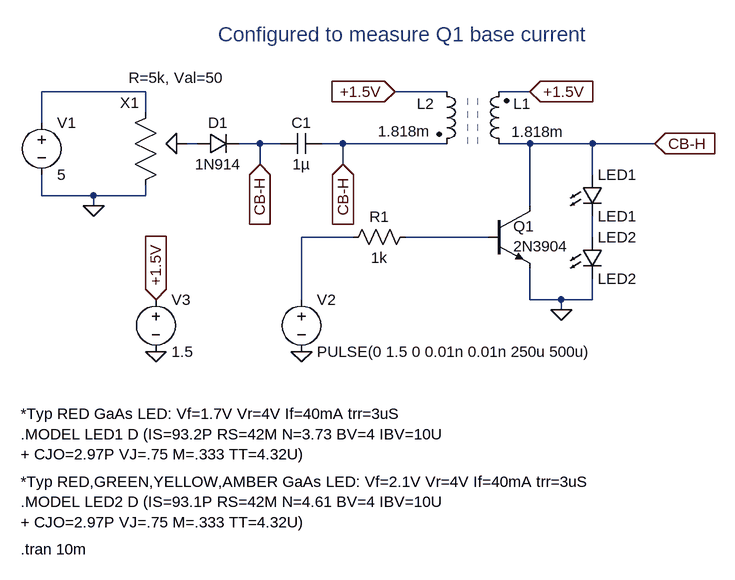
[diagram p0: schematic configured_to_measure_Q1_base_current_ltspice.asc]
configured_to_measure_Q1_base_current_ltspice.asc, the LTspice schematic file:
Version 4
SHEET 1 880 880
WIRE -320 160 -480 160
WIRE 144 160 64 160
WIRE 272 160 224 160
WIRE -320 192 -320 160
WIRE -480 208 -480 160
WIRE -240 240 -256 240
WIRE -144 240 -176 240
WIRE -112 240 -144 240
WIRE -16 240 -48 240
WIRE 144 240 -16 240
WIRE 272 240 224 240
WIRE 368 240 272 240
WIRE 464 240 368 240
WIRE -144 272 -144 240
WIRE -16 272 -16 240
WIRE 368 288 368 240
WIRE -480 320 -480 288
WIRE -400 320 -480 320
WIRE -320 320 -320 304
WIRE -320 320 -400 320
WIRE -400 336 -400 320
WIRE 272 336 272 240
WIRE 0 384 -80 384
WIRE 208 384 80 384
WIRE 368 384 368 352
WIRE -80 480 -80 384
WIRE 272 480 272 432
WIRE 320 480 272 480
WIRE 368 480 368 448
WIRE 368 480 320 480
WIRE 320 496 320 480
FLAG -400 336 0
FLAG 64 160 +1.5V
IOPIN 64 160 In
FLAG 272 160 +1.5V
IOPIN 272 160 In
FLAG -144 272 CB-H
IOPIN -144 272 In
FLAG -16 272 CB-H
IOPIN -16 272 In
FLAG 320 496 0
FLAG 464 240 CB-H
IOPIN 464 240 In
FLAG -80 560 0
FLAG -304 560 0
FLAG -304 480 +1.5V
IOPIN -304 480 In
SYMBOL ind2 240 256 R180
WINDOW 0 -33 77 Left 2
WINDOW 3 -3 34 Right 2
SYMATTR InstName L1
SYMATTR Value 1.818m
SYMATTR Type ind
SYMBOL ind2 128 144 R0
WINDOW 0 -30 35 Left 2
WINDOW 3 -90 77 Left 2
SYMATTR InstName L2
SYMATTR Value 1.818m
SYMATTR Type ind
SYMBOL cap -48 224 R90
WINDOW 0 0 32 VBottom 2
WINDOW 3 32 32 VTop 2
SYMATTR InstName C1
SYMATTR Value 1µ
SYMBOL diode -240 256 R270
WINDOW 0 32 32 VTop 2
WINDOW 3 0 32 VBottom 2
SYMATTR InstName D1
SYMATTR Value 1N914
SYMBOL potentiometer -304 208 M0
WINDOW 39 -104 -69 Left 2
SYMATTR SpiceLine R=5k, Val=50
SYMATTR InstName X1
SYMBOL voltage -480 192 R0
SYMATTR InstName V1
SYMATTR Value 5
SYMBOL LED 352 288 R0
SYMATTR InstName LED1
SYMATTR Value LED1
SYMBOL LED 352 384 R0
SYMATTR InstName LED2
SYMATTR Value LED2
SYMBOL npn 208 336 R0
WINDOW 0 38 31 Left 2
WINDOW 3 38 62 Left 2
SYMATTR InstName Q1
SYMATTR Value 2N3904
SYMBOL res 96 368 R90
WINDOW 0 0 56 VBottom 2
WINDOW 3 32 56 VTop 2
SYMATTR InstName R1
SYMATTR Value 1k
SYMBOL voltage -80 464 R0
WINDOW 123 0 0 Left 0
WINDOW 39 0 0 Left 0
SYMATTR InstName V2
SYMATTR Value PULSE(0 1.5 0 0.01n 0.01n 250u 500u)
SYMBOL voltage -304 464 R0
WINDOW 123 0 0 Left 0
WINDOW 39 0 0 Left 0
SYMATTR InstName V3
SYMATTR Value 1.5
TEXT -208 72 Left 3 ;Configured to measure Q1 base current
TEXT -512 656 Left 2 !*Typ RED GaAs LED: Vf=1.7V Vr=4V If=40mA trr=3uS\n.MODEL LED1 D (IS=93.2P RS=42M N=3.73 BV=4 IBV=10U\n+ CJO=2.97P VJ=.75 M=.333 TT=4.32U)
TEXT -512 760 Left 2 !*Typ RED,GREEN,YELLOW,AMBER GaAs LED: Vf=2.1V Vr=4V If=40mA trr=3uS\n.MODEL LED2 D (IS=93.1P RS=42M N=4.61 BV=4 IBV=10U\n+ CJO=2.97P VJ=.75 M=.333 TT=4.32U)
TEXT -512 864 Left 2 !.tran 10m
LINE Normal 176 240 176 160 2
LINE Normal 192 240 192 160 2

The netlist it stands for:
* configured_to_measure_Q1_base_current_ltspice.asc
L1 CB-H +1.5V 1.818m
L2 +1.5V CB-H 1.818m
C1 CB-H CB-H 1µ
D1 N002 CB-H 1N914
XX1 N001 N002 0 potentiometer R=5k, Val=50  ; pins 1 2 3
V1 N001 0 5
D§LED1 CB-H N005 LED1
D§LED2 N005 0 LED2
Q1 CB-H N004 0 0 2N3904
R1 N004 N003 1k
V2 N003 0 PULSE(0 1.5 0 0.01n 0.01n 250u 500u)
V3 +1.5V 0 1.5
.model D D
.lib standard.dio
.model NPN NPN
.model PNP PNP
.lib standard.bjt
* Configured to measure Q1 base current
*Typ RED GaAs LED: Vf=1.7V Vr=4V If=40mA trr=3uS
.MODEL LED1 D (IS=93.2P RS=42M N=3.73 BV=4 IBV=10U
+ CJO=2.97P VJ=.75 M=.333 TT=4.32U)
*Typ RED,GREEN,YELLOW,AMBER GaAs LED: Vf=2.1V Vr=4V If=40mA trr=3uS
.MODEL LED2 D (IS=93.1P RS=42M N=4.61 BV=4 IBV=10U
+ CJO=2.97P VJ=.75 M=.333 TT=4.32U)
.tran 10m
.backanno
.end